# EAGLE design heights-no-branding (EAGLE 9.6.2)
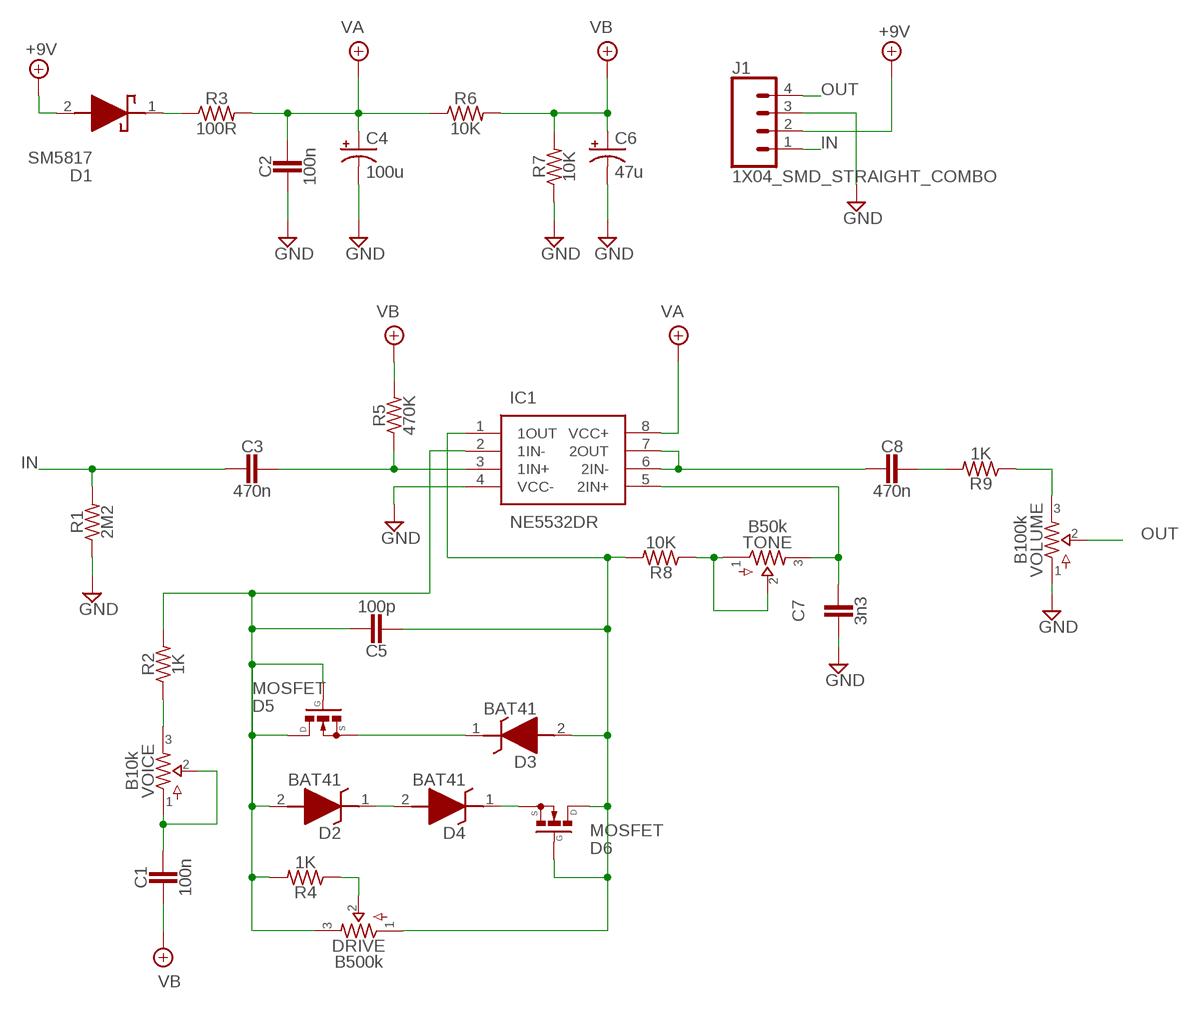
[diagram p0: schematic, sheet 1]

## Parts
C1  100n  CAP1206  [RESISTOR_C1206]
C2  100n  CAP0603  [RESISTOR_R0603]
C3  470n  CAP1206  [RESISTOR_C1206]
C4  100u  0631  [063_025]
C5  100p  CAP0603  [RESISTOR_R0603]
C6  47u  0501  [050_020_1]
C7  3n3  CAP0603  [RESISTOR_R0603]
C8  470n  CAP1206  [RESISTOR_C1206]
D1  SM5817  SM5817PL-TP  [SOD3716X120N]
D2  BAT41  MM1Z4733A  [SODFL3718X130N]
D3  BAT41  MM1Z4733A  [SODFL3718X130N]
D4  BAT41  MM1Z4733A  [SODFL3718X130N]
D5  MOSFET  [TRANSISTOR_SOT23-GDS]
D6  MOSFET  [TRANSISTOR_SOT23-GDS]
DRIVE  B500k  16MM.1  [16MM_B.MOUNT]
IC1  NE5532DR  [SOIC127P600X175-8N]
J1  1X04_SMD_STRAIGHT_COMBO  CONN_04PTH  [1X04]
R1  2M2  RESISTOR0603  [RESISTOR_R0603]
R2  1K  RESISTOR0603  [RESISTOR_R0603]
R3  100R  RESISTOR0603  [RESISTOR_R0603]
R4  1K  RESISTOR0603  [RESISTOR_R0603]
R5  470K  RESISTOR0603  [RESISTOR_R0603]
R6  10K  RESISTOR0603  [RESISTOR_R0603]
R7  10K  RESISTOR0603  [RESISTOR_R0603]
R8  10K  RESISTOR0603  [RESISTOR_R0603]
R9  1K  RESISTOR0603  [RESISTOR_R0603]
TONE  B50k  16MM.1  [16MM_B.MOUNT]
VOICE  B10k  16MM.1  [16MM_B.MOUNT]
VOLUME  B100k  16MM.1  [16MM_B.MOUNT]

## Nets
+9V: D1.2(A) J1.2
GND: C2.2 C4.- C6.- C7.2 IC1.4(VCC-) J1.3 R1.1 R7.1 VOLUME.1
IN: C3.2 J1.1 R1.2
N$1: D1.1(K) R3.1
N$2: D2.1(K) D4.2(A)
N$3: C3.1 IC1.3(1IN+) R5.1
N$4: C5.1 D2.2(A) D5.D D5.G DRIVE.3 IC1.2(1IN-) R2.2 R4.2
N$5: R2.1 VOICE.3
N$6: C1.1 VOICE.1 VOICE.2
N$7: DRIVE.2 R4.1
N$8: C5.2 D3.2(A) D6.D D6.G DRIVE.1 IC1.1(1OUT) R8.2
N$10: D3.1(K) D5.S
N$11: D4.1(K) D6.S
N$12: R8.1 TONE.1 TONE.2
N$13: C7.1 IC1.5(2IN+) TONE.3
N$14: C8.2 IC1.6(2IN-) IC1.7(2OUT)
N$15: C8.1 R9.2
N$16: R9.1 VOLUME.3
OUT: J1.4 VOLUME.2
VA: C2.1 C4.+ IC1.8(VCC+) R3.2 R6.1
VB: C1.2 C6.+ R5.2 R6.2 R7.2

## Library data of the parts
C1-C3 C5 C7 C8 = heights-no-branding:CAP
C4 = heights-no-branding:063: 33 - 220uF Xicon values at Mouser.com 10V: 220uF; 16V: 100uF; 25V: 100uF; 50V: 33uF
C6 = heights-no-branding:050: 0.22 - 100uF Xicon values at Mouser.com: 10V: 10 - 100uF; 16V: 2.2 - 47uF; 25V: 0.47 - 47uF; 50V: 0.22 - 22uF
D1 = heights-no-branding:SM5817PL-TP: Schottky Barrier Rectifiers Source: Datasheet <https://mccsemi.com/pdf/Products/SM5817PL-SM5819PL(SOD-123FL).pdf>; DESCRIPTION: Schottky Barrier Rectifiers; HEIGHT: 1.2mm; MANUFACTURER_NAME: MCC; MANUFACTURER_PART_NUMBER: SM5817PL-TP; MOUSER_PART_NUMBER: 833-SM5817PL-TP; MOUSER_PRICE-STOCK: https://www.mouser.co.uk/ProductDetail/Micro-Commercial-Components-MCC/SM5817PL-TP?qs=SdqRYZZ9IxAlhPsFLNd53A%3D%3D
D2-D4 = heights-no-branding:MM1Z4733A: Zener Diodes Zener, SOD-123FL, 5.1V, 1W, 5% Source: Datasheet <https://diotec.com/request/datasheet/mm1z4728.pdf>; DESCRIPTION: Zener Diodes Zener, SOD-123FL, 5.1V, 1W, 5%; HEIGHT: 1.3mm; MANUFACTURER_NAME: Diotec; MANUFACTURER_PART_NUMBER: MM1Z4733A; MOUSER_PART_NUMBER: 637-MM1Z4733A; MOUSER_PRICE-STOCK: https://www.mouser.co.uk/ProductDetail/Diotec-Semiconductor/MM1Z4733A?qs=OlC7AqGiEDnZm53%252BKpLGUg%3D%3D
D5 D6 = heights-no-branding:MOSFET
DRIVE TONE VOICE VOLUME = heights-no-branding:16MM: 16mm Poteniometers
IC1 = heights-no-branding:NE5532DR: NE5532DR, Dual Operational Amplifier 10MHz, 8-Pin SOIC Source: Datasheet <http://www.ti.com/lit/ds/symlink/ne5532.pdf>; DESCRIPTION: NE5532DR, Dual Operational Amplifier 10MHz, 8-Pin SOIC; HEIGHT: 1.75mm; MANUFACTURER_NAME: Texas Instruments; MANUFACTURER_PART_NUMBER: NE5532DR; MOUSER_PART_NUMBER: 595-NE5532DR; MOUSER_PRICE-STOCK: https://www.mouser.co.uk/ProductDetail/Texas-Instruments/NE5532DR?qs=LzFo6vGRJ4tu9UjwVgwNUQ%3D%3D
J1 = heights-no-branding:CONN_04: Multi connection point. Often used as Generic Header-pin footprint for 0.1 inch spaced/style header connections On any of the 0.1 inch spaced packages, you can populate with these: Break Away Headers - Straight <https://www.sparkfun.com/products/116> (PRT-00116) Break Away Male Headers - Right Angle <https://www.sparkfun.com/products/553> (PRT-00553) Female Headers <https://www.sparkfun.com/products/115> (PRT-00115) Break Away Headers - Machine Pin <https://www.sparkfun.com/products/117> (PRT-00117) Break Away Female Headers - Swiss Machine Pin <https://www.sparkfun.com/products/743> (PRT-00743) For SCREWTERMINALS and SPRING TERMINALS visit here: Screw Terimnals on SparkFun.com <https://www.sparkfun.com/search/results?term=Screw+Terminals> (5mm/3.5mm/2.54mm spacing) This device is also useful as a general connection point to wire up your design to another part of your project. Our various solder wires solder well into these plated through hole pads. Hook-Up Wire - Assortment (Stranded, 22 AWG) <https://www.sparkfun.com/products/11375> (PRT-11375) Hook-Up Wire - Assortment (Solid Core, 22 AWG) <https://www.sparkfun.com/products/11367> (PRT-11367) View the entire wire category on our website here <https://www.sparkfun.com/categories/141> Special notes: Molex polarized connector foot print use with SKU : PRT-08231 with associated crimp pins and housings. 1MM SMD Version SKU: PRT-10208; PROD_ID: CONN-14363; SF_ID: PRT-08075; STOREFRONT_SKU: PRT-15900
R1-R9 = heights-no-branding:RESISTOR

## Board
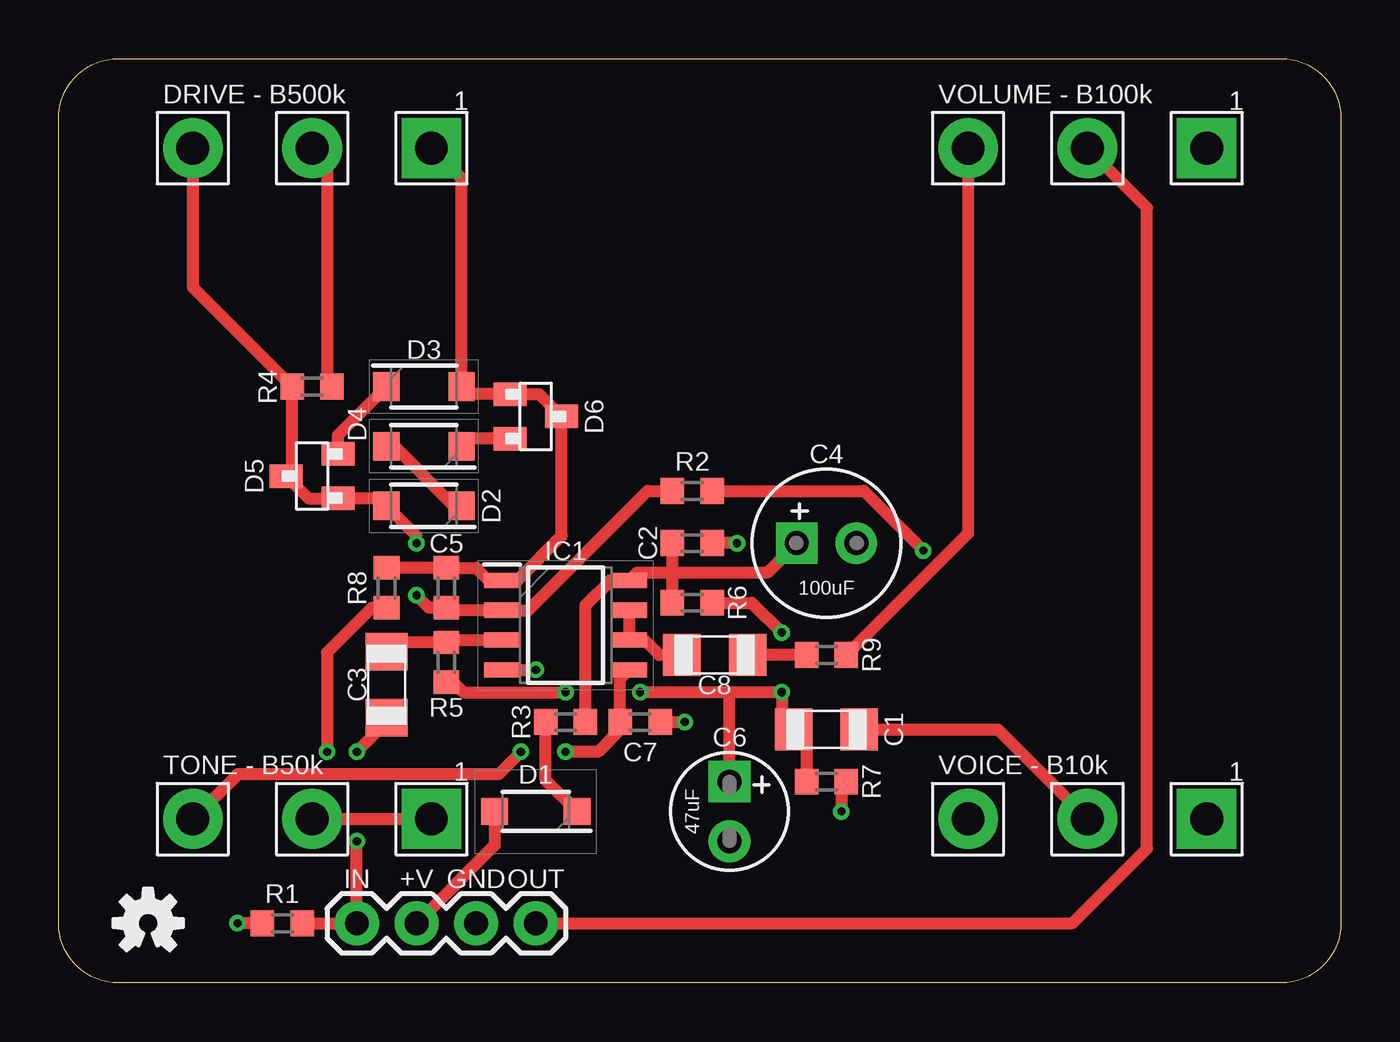
[diagram p1: board, top side]
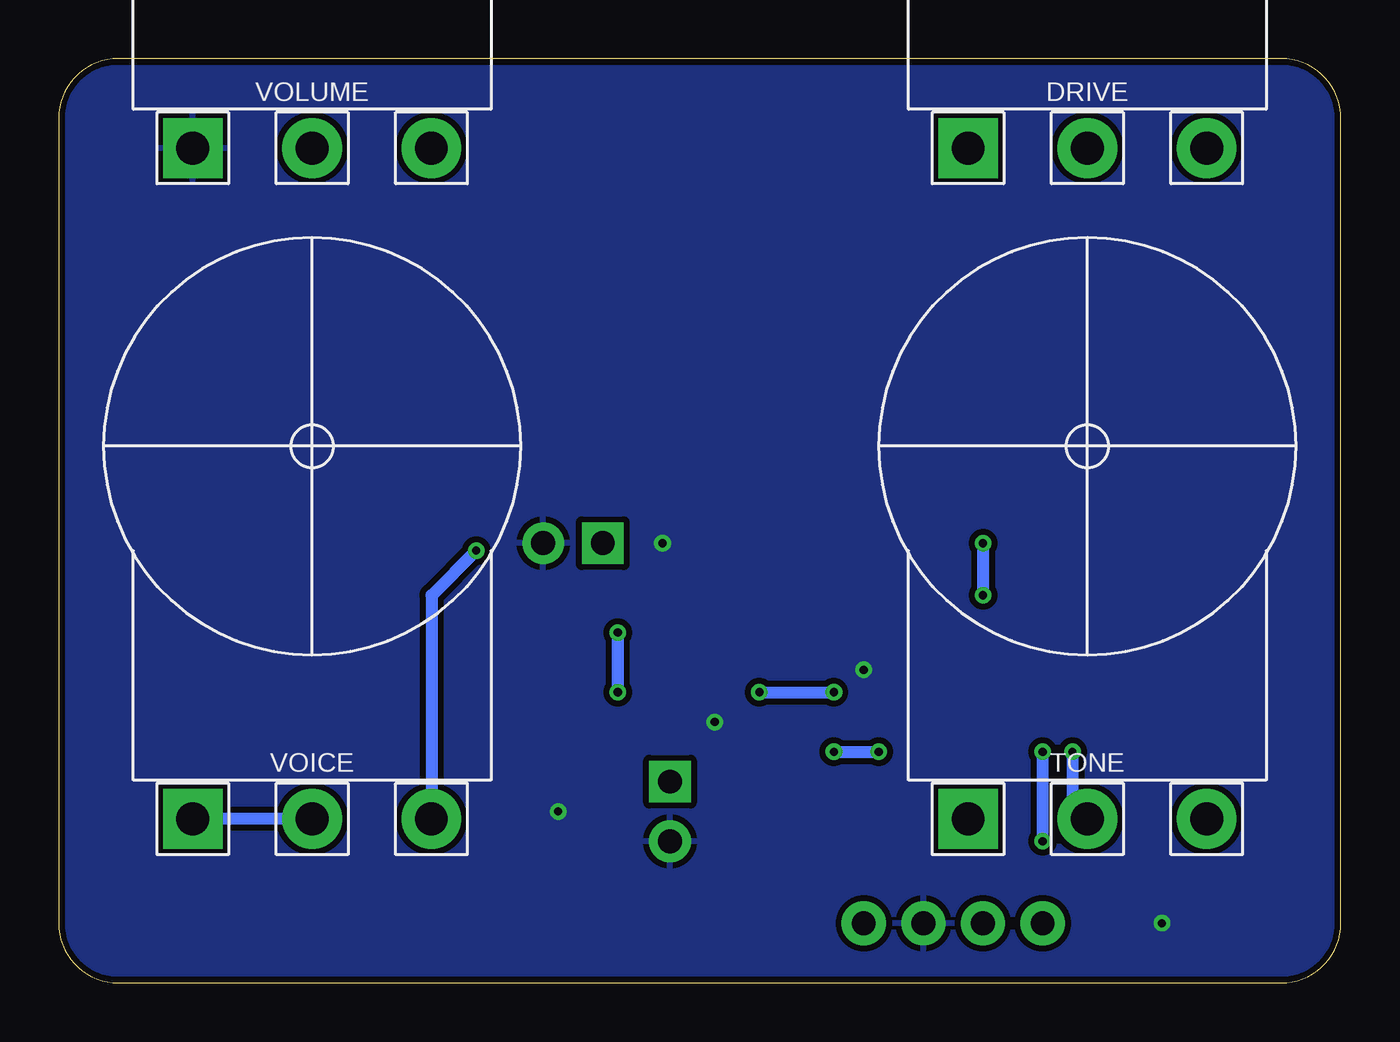
[diagram p2: board, bottom side, seen from below]

Size 54.61 x 39.37 mm. Coordinates in mm from the lower left corner, seen from the top.
Outline: 52.07,0 2.54,0 arc-90 0,2.54 0,36.83 arc-90 2.54,39.37 52.07,39.37 arc-90 54.61,36.83 54.61,2.54 arc-90 52.07,0
Copper layers (1*16): Top 0.035mm / dielectric 1.5mm / Bottom 0.035mm
Design rules "SparkFun-2-Layer-General-JLCPCB": minimum track width 7mil, minimum drill 0.3mm, track to track 7mil, track to pad 7mil, pad to pad 7mil, via to via 7mil, smd to smd 7mil, copper to edge 7mil, drill to drill 7mil, minimum pad ring 7mil, minimum via ring 7mil, stop-mask expansion 3mil, vias tented up to drill 25mil, thermal gap 10mil

### Footprints (pad centres in the part's own frame; a part is rotated, then mirrored left to right if it is on the bottom)
RESISTOR_C1206 = smd 1.6 x 1.8: 1 -1.4,0; 2 1.4,0
RESISTOR_R0603 = smd 1 x 1.1: 1 -0.85,0; 2 0.85,0
063_025 = drill 1.016 pad 1.778 square: + -1.27,0 | drill 1.016 pad 1.778: - 1.27,0
050_020_1 = drill 1.016 pad 1.778 square: + -1.27,0 | drill 1.016 pad 1.778: - 1.27,0
SOD3716X120N = smd 1.15 x 1.15: 1 -1.75,0; 2 1.75,0
SODFL3718X130N = smd 1.12 x 1.22: 1 -1.6,0; 2 1.6,0
TRANSISTOR_SOT23-GDS = smd 1 x 1.4: D 0,1.1; G -0.95,-1.1; S 0.95,-1.1
16MM_B.MOUNT = drill 1.4 pad 2.54 square: 1 5.08,0 | drill 1.4 pad 2.54: 2 0,0; 3 -5.08,0
SOIC127P600X175-8N = smd 1.528 x 0.65: 1 -2.711,1.905; 2 -2.711,0.635; 3 -2.711,-0.635; 4 -2.711,-1.905; 5 2.711,-1.905; 6 2.711,-0.635; 7 2.711,0.635; 8 2.711,1.905
1X04 = drill 1.016 pad 1.88: 1 0,0; 2 2.54,0; 3 5.08,0; 4 7.62,0

### Placement (x,y rotation side)
C1  32.7,10.79 180 top
C2  26.99,18.73 0 top
C3  13.97,12.7 270 top
C4  32.7,18.73 0 top
C5  16.51,16.83 90 top
C6  28.57,7.3 270 top
C7  24.77,11.11 0 top
C8  27.94,13.97 180 top
D1  20.32,7.3 180 top
D2  15.56,20.32 180 top
D3  15.56,25.4 0 top
D4  15.56,22.86 180 top
D5  10.79,21.59 90 top
D6  20.32,24.13 270 top
DRIVE  10.79,35.56 0 top
IC1  21.59,15.24 0 top
J1  12.7,2.54 0 top
R1  9.53,2.54 0 top
R2  26.99,20.95 180 top
R3  21.59,11.11 0 top
R4  10.79,25.4 180 top
R5  16.51,13.65 270 top
R6  26.99,16.19 0 top
R7  32.7,8.57 180 top
R8  13.97,16.83 90 top
R9  32.7,13.97 180 top
TONE  10.79,6.99 0 top
U$2  [OSHW-LOGO-S]  3.81,2.54 0 top
VOICE  43.81,6.99 0 top
VOLUME  43.81,35.56 0 top

### Tracks (layer width: path | path; a pad name or v marks a point on that pad's centre or on a via)
+9V
  Top 0.508: J1.2 18.57,5.87 D1.2
GND  (via drill 0.35)
  Top 0.508: IC1.4 v20.32,13.34 | R1.1 v7.62,2.54 | v28.89,18.73 C2.2 | R7.1 33.34,8.36 v33.34,7.3 | C7.2 v26.67,11.11
  pour Bottom (isolate 0.254): 0,19.68 0,36.83 arc-90 2.54,39.37 27.3,39.37 52.07,39.37 arc-90 54.61,36.83 54.61,13.34 54.61,2.54 arc-90 52.07,0 13.97,0 2.54,0 arc-90 0,2.54
IN  (via drill 0.35)
  Top 0.508: R1.2 J1.1 v12.7,6.03 | C3.2 13.97,11.11 v12.7,9.84
  Bottom 0.508: v12.7,6.03 v12.7,9.84
N$1
  Top 0.508: D1.1 20.74,8.63 R3.1
N$2
  Top 0.508: D4.2 14.3,22.86 16.84,20.32 D2.1
N$3
  Top 0.508: IC1.3 16.61,14.61 R5.1 14.37,14.5 C3.1
N$4  (via drill 0.35)
  Top 0.508: R2.2 25.08,20.95 20,15.88 IC1.2 16.61,15.88 C5.1 15.77,15.98 v15.24,16.51 | DRIVE.3 5.71,29.63 R4.2 9.95,21.84 D5.D 10.64,20.64 D5.G 13.64,20.64 D2.2 15.24,19.04 v15.24,18.73
  Bottom 0.508: v15.24,18.73 v15.24,16.51
N$5  (via drill 0.35)
  Top 0.508: R2.1 34.29,20.95 v36.83,18.41
  Bottom 0.508: v36.83,18.41 38.73,16.51 VOICE.3
N$6
  Top 0.508: VOICE.2 40.01,10.79 C1.1
  Bottom 0.508: VOICE.2 VOICE.1
N$7
  Top 0.508: R4.1 11.43,25.61 11.43,34.92 DRIVE.2
N$8
  Top 0.508: R8.2 C5.2 17.78,17.68 18.31,17.14 IC1.1 19.51,17.14 21.42,19.05 D6.D 20.47,25.08 D6.G 17.63,25.08 17.31,25.4 D3.2 17.14,25.41 17.14,34.29 DRIVE.1
N$10
  Top 0.508: D5.S 11.89,23.34 D3.1
N$11
  Top 0.508: D4.1 17.48,23.18 D6.S
N$12  (via drill 0.35)
  Top 0.508: R8.1 13.34,15.98 11.43,14.07 v11.43,9.84 | TONE.2 TONE.1
  Bottom 0.508: v11.43,9.84 11.43,7.62 TONE.2
N$13  (via drill 0.35)
  Top 0.508: IC1.5 23.91,12.95 C7.1 23.91,10.79 22.96,9.84 v21.59,9.84 | TONE.3 7.62,8.89 18.73,8.89 v19.68,9.84
  Bottom 0.508: v21.59,9.84 v19.68,9.84
N$14
  Top 0.508: IC1.7 IC1.6 24.95,14.61 25.59,13.97 C8.2
N$15
  Top 0.508: R9.2 C8.1
N$16
  Top 0.508: VOLUME.3 38.73,19.15 R9.1
OUT
  Top 0.508: VOLUME.2 46.35,33.02 46.35,5.71 43.18,2.54 J1.4
VA
  Top 0.508: R3.2 22.44,16.09 23.5,17.14 IC1.8 24.62,17.46 26.14,17.46 | R6.1 26.14,17.46 | 26.14,17.46 C2.1 | C4.+ 30.16,17.46 26.14,17.46
VB  (via drill 0.35)
  Top 0.508: R5.2 16.83,12.8 17.25,12.38 v21.59,12.38 | 28.57,12.38 v30.8,12.38 30.8,11.3 C1.2 31.85,10.24 R7.2 | 28.57,12.38 v24.77,12.38 | R6.2 29.53,16.19 v30.8,14.92 | C6.+ 28.57,12.38
  Bottom 0.508: v30.8,14.92 v30.8,12.38 | v24.77,12.38 v21.59,12.38

### Text on the board
tPlace: DRIVE - B500k | VOLUME - B100k | 100uF | TONE - B50k | VOICE - B10k | 47uF | IN | +V | GND | OUT